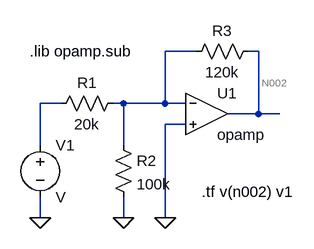
[diagram p0: schematic pag8es7p1.asc]
pag8es7p1.asc, the LTspice schematic file:
Version 4
SHEET 1 880 680
WIRE 272 -64 224 -64
WIRE 368 -64 352 -64
WIRE 64 16 32 16
WIRE 160 16 144 16
WIRE 224 16 224 -64
WIRE 224 16 160 16
WIRE 256 16 224 16
WIRE 368 32 368 -64
WIRE 368 32 320 32
WIRE 400 32 368 32
WIRE 256 48 224 48
WIRE 32 80 32 16
WIRE 160 80 160 16
WIRE 32 192 32 160
WIRE 160 192 160 160
WIRE 224 192 224 48
FLAG 32 192 0
FLAG 160 192 0
FLAG 224 192 0
SYMBOL voltage 32 64 R0
SYMATTR InstName V1
SYMBOL res 48 32 R270
WINDOW 0 32 56 VTop 2
WINDOW 3 0 56 VBottom 2
SYMATTR InstName R1
SYMATTR Value 20k
SYMBOL res 144 64 R0
SYMATTR InstName R2
SYMATTR Value 100k
SYMBOL OpAmps\\opamp 288 -32 R0
SYMATTR InstName U1
SYMBOL res 256 -48 R270
WINDOW 0 32 56 VTop 2
WINDOW 3 0 56 VBottom 2
SYMATTR InstName R3
SYMATTR Value 120k
TEXT 16 -64 Left 2 !.lib opamp.sub
TEXT 280 152 Left 2 !.tf v(n002) v1

The netlist it stands for:
* pag8es7p1.asc
V1 N003 0 V
R1 N003 N001 20k
R2 N001 0 100k
XU1 N001 0 N002 opamp Aol=100K GBW=10Meg  ; pins invin noninvin out
R3 N001 N002 120k
.lib opamp.sub
.tf v(n002) v1
.backanno
.end